# Altium schematic sheet Relay Board_Rev1-3 - Altium.schdoc
size 604 x 429 mm
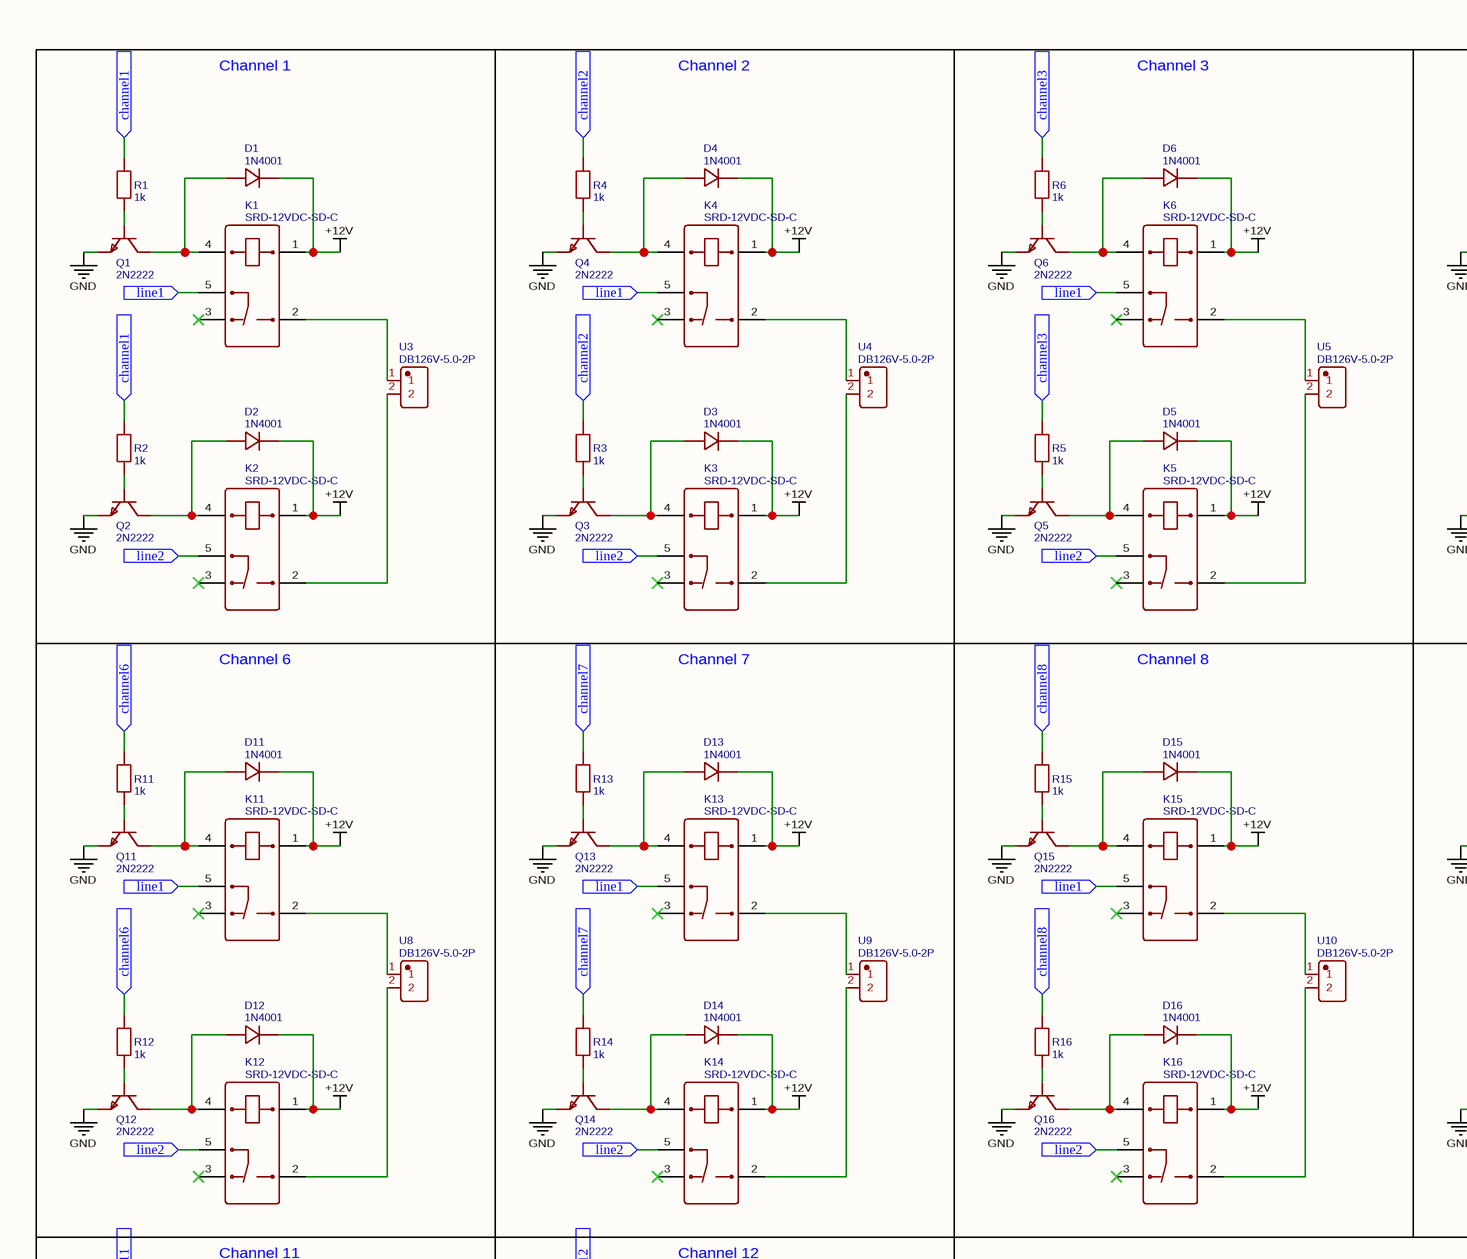
[diagram p0: Relay Board_Rev1-3 - Altium.schdoc, top left]
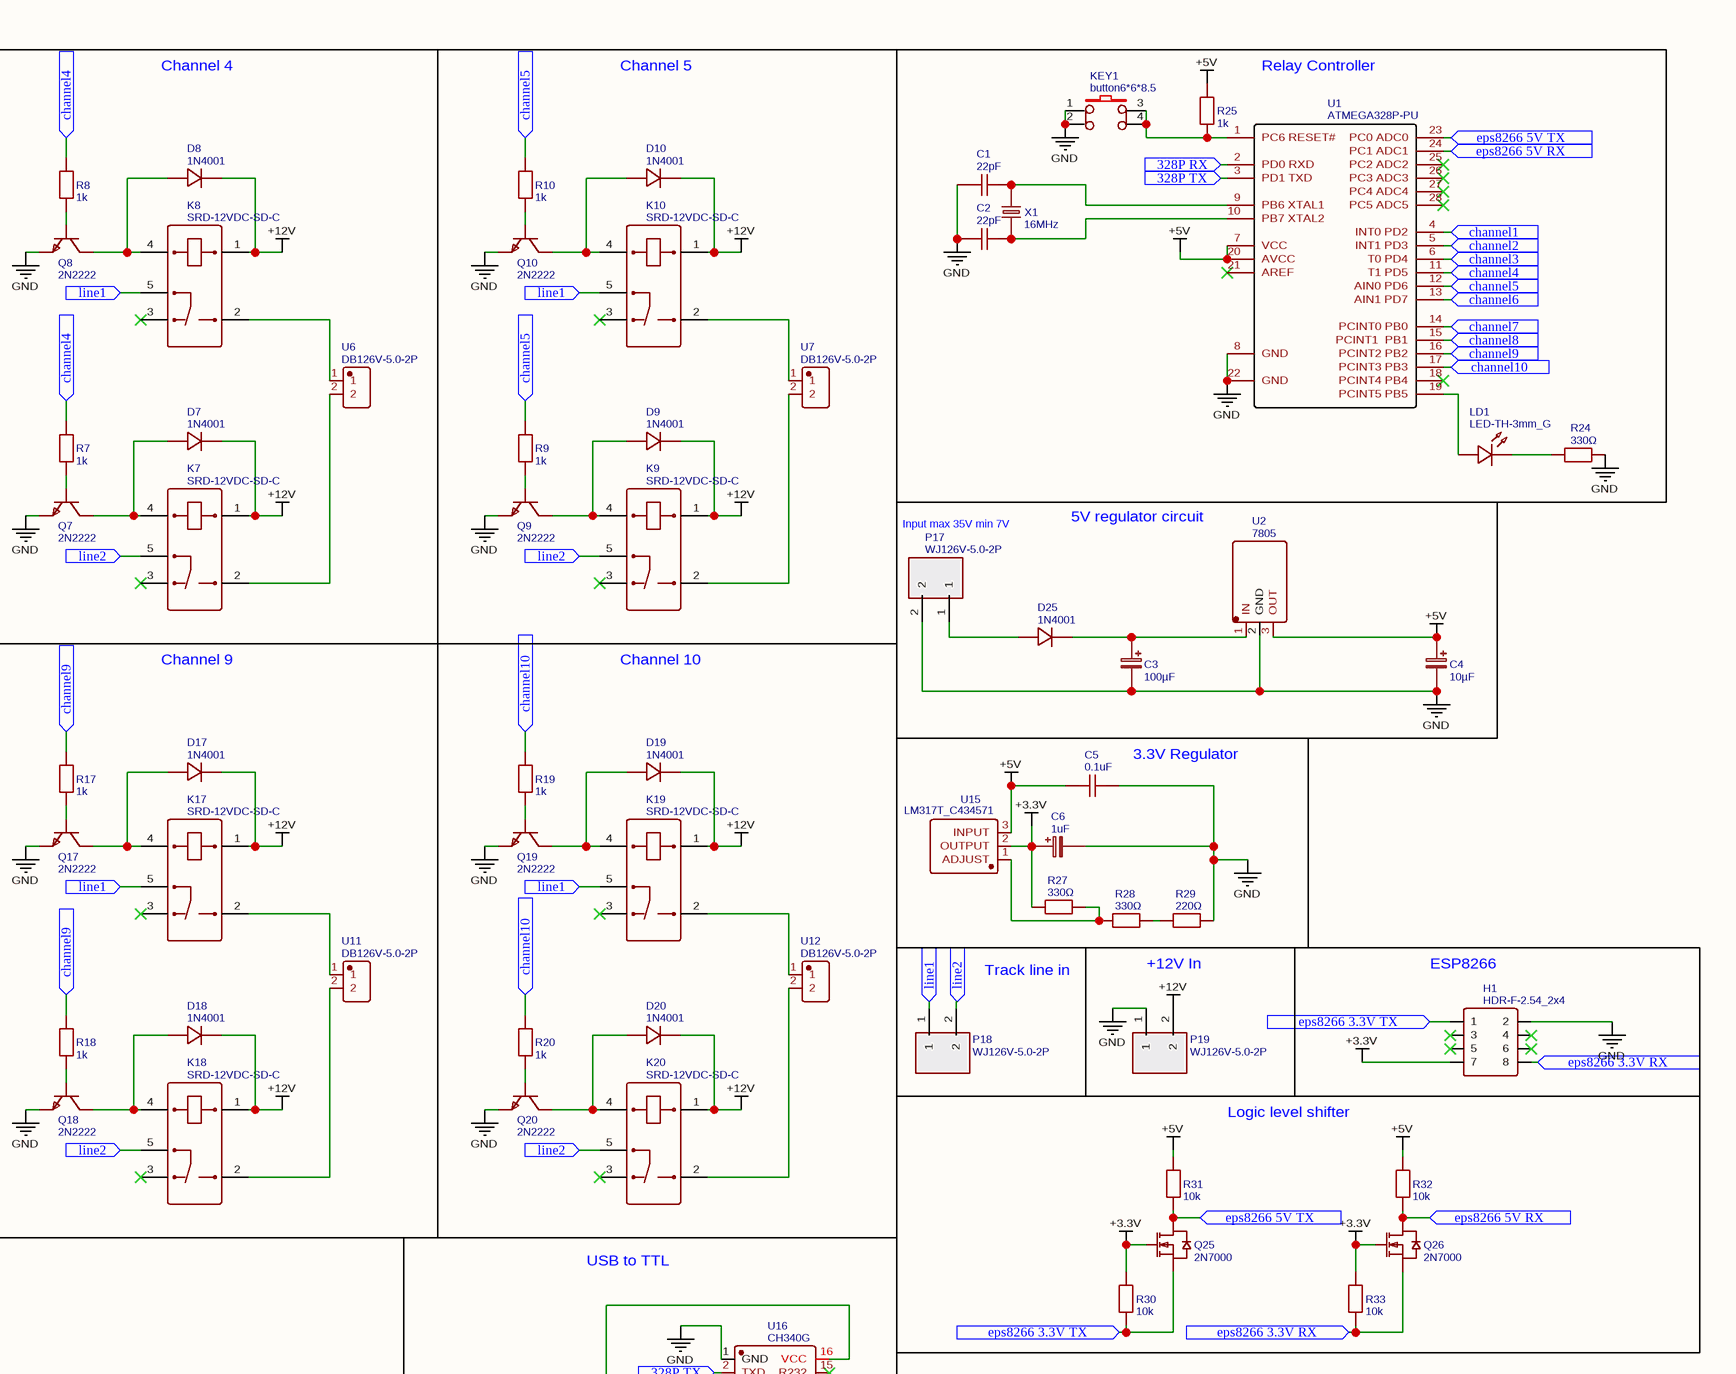
[diagram p1: Relay Board_Rev1-3 - Altium.schdoc, top right]
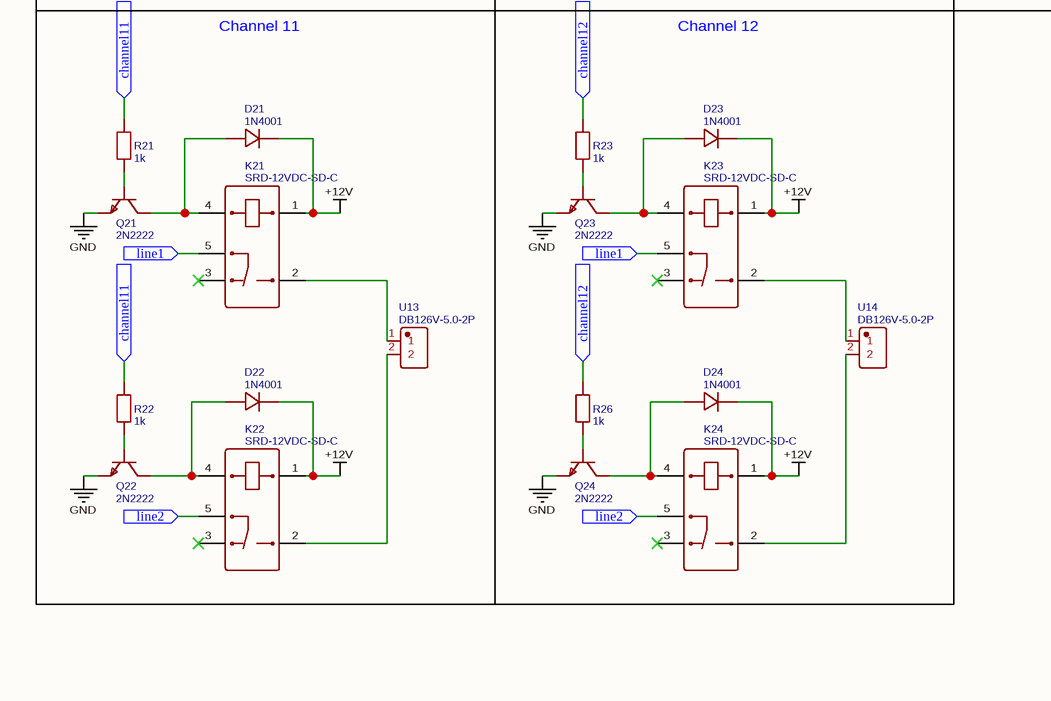
[diagram p2: Relay Board_Rev1-3 - Altium.schdoc, bottom left]
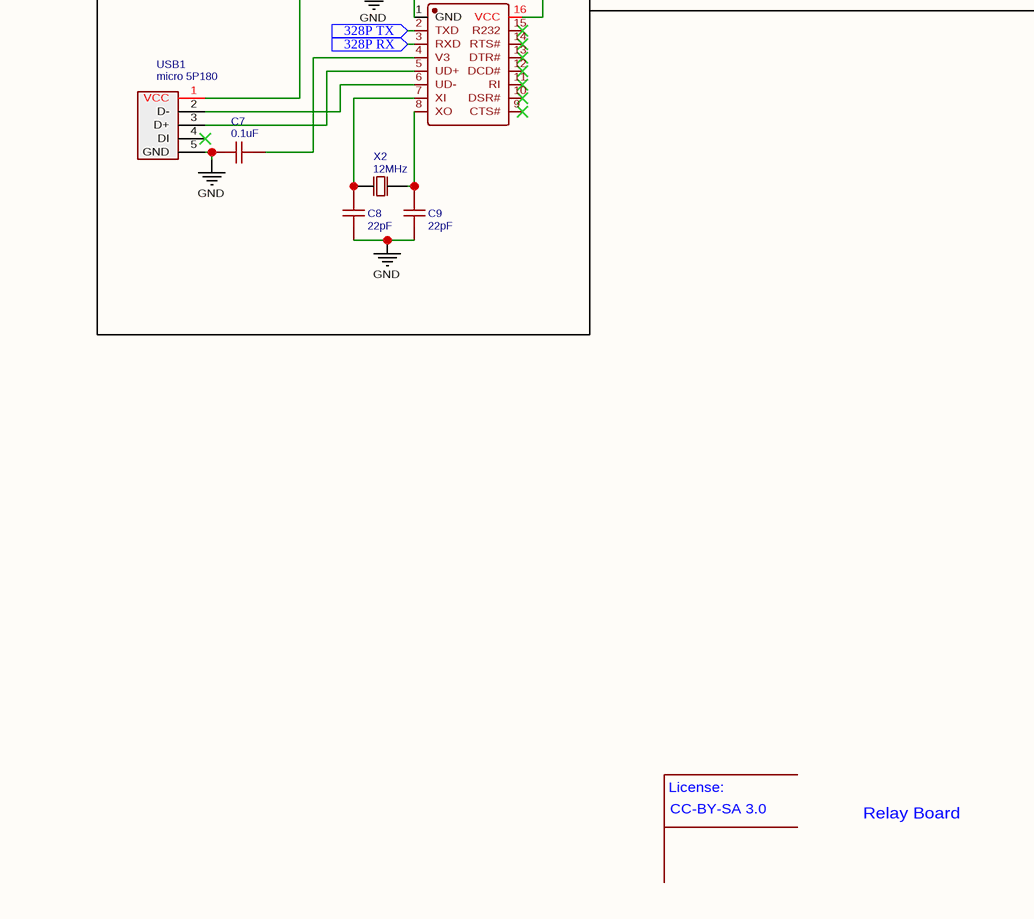
[diagram p3: Relay Board_Rev1-3 - Altium.schdoc, bottom right]

## Parts
C1  22pF  [RAD-0.2]
C2  22pF  [RAD-0.2]
C3  100µF  [CAP-D3.0×F1.5]
C4  10µF  [CAP-D3.0×F1.5]
C5  0.1uF  [RAD-0.2]
C6  1uF  [CAP-D3.0×F1.5]
C7  0.1uF  [RAD-0.2]
C8  22pF  [RAD-0.2]
C9  22pF  [RAD-0.2]
D1  1N4001  [DO-41_BD2.4-L4.7-P8.70-D0.9-RD]
D2  1N4001  [DO-41_BD2.4-L4.7-P8.70-D0.9-RD]
D3  1N4001  [DO-41_BD2.4-L4.7-P8.70-D0.9-RD]
D4  1N4001  [DO-41_BD2.4-L4.7-P8.70-D0.9-RD]
D5  1N4001  [DO-41_BD2.4-L4.7-P8.70-D0.9-RD]
D6  1N4001  [DO-41_BD2.4-L4.7-P8.70-D0.9-RD]
D7  1N4001  [DO-41_BD2.4-L4.7-P8.70-D0.9-RD]
D8  1N4001  [DO-41_BD2.4-L4.7-P8.70-D0.9-RD]
D9  1N4001  [DO-41_BD2.4-L4.7-P8.70-D0.9-RD]
D10  1N4001  [DO-41_BD2.4-L4.7-P8.70-D0.9-RD]
D11  1N4001  [DO-41_BD2.4-L4.7-P8.70-D0.9-RD]
D12  1N4001  [DO-41_BD2.4-L4.7-P8.70-D0.9-RD]
D13  1N4001  [DO-41_BD2.4-L4.7-P8.70-D0.9-RD]
D14  1N4001  [DO-41_BD2.4-L4.7-P8.70-D0.9-RD]
D15  1N4001  [DO-41_BD2.4-L4.7-P8.70-D0.9-RD]
D16  1N4001  [DO-41_BD2.4-L4.7-P8.70-D0.9-RD]
D17  1N4001  [DO-41_BD2.4-L4.7-P8.70-D0.9-RD]
D18  1N4001  [DO-41_BD2.4-L4.7-P8.70-D0.9-RD]
D19  1N4001  [DO-41_BD2.4-L4.7-P8.70-D0.9-RD]
D20  1N4001  [DO-41_BD2.4-L4.7-P8.70-D0.9-RD]
D21  1N4001  [DO-41_BD2.4-L4.7-P8.70-D0.9-RD]
D22  1N4001  [DO-41_BD2.4-L4.7-P8.70-D0.9-RD]
D23  1N4001  [DO-41_BD2.4-L4.7-P8.70-D0.9-RD]
D24  1N4001  [DO-41_BD2.4-L4.7-P8.70-D0.9-RD]
D25  1N4001  [DO-41_BD2.4-L4.7-P8.70-D0.9-RD]
H1  HDR-F-2.54_2x4  [HDR-F-2.54_2X4]
K1  SRD-12VDC-SD-C  [RELAY-TH_SRD-XXVDC-SD-C]
K2  SRD-12VDC-SD-C  [RELAY-TH_SRD-XXVDC-SD-C]
K3  SRD-12VDC-SD-C  [RELAY-TH_SRD-XXVDC-SD-C]
K4  SRD-12VDC-SD-C  [RELAY-TH_SRD-XXVDC-SD-C]
K5  SRD-12VDC-SD-C  [RELAY-TH_SRD-XXVDC-SD-C]
K6  SRD-12VDC-SD-C  [RELAY-TH_SRD-XXVDC-SD-C]
K7  SRD-12VDC-SD-C  [RELAY-TH_SRD-XXVDC-SD-C]
K8  SRD-12VDC-SD-C  [RELAY-TH_SRD-XXVDC-SD-C]
K9  SRD-12VDC-SD-C  [RELAY-TH_SRD-XXVDC-SD-C]
K10  SRD-12VDC-SD-C  [RELAY-TH_SRD-XXVDC-SD-C]
K11  SRD-12VDC-SD-C  [RELAY-TH_SRD-XXVDC-SD-C]
K12  SRD-12VDC-SD-C  [RELAY-TH_SRD-XXVDC-SD-C]
K13  SRD-12VDC-SD-C  [RELAY-TH_SRD-XXVDC-SD-C]
K14  SRD-12VDC-SD-C  [RELAY-TH_SRD-XXVDC-SD-C]
K15  SRD-12VDC-SD-C  [RELAY-TH_SRD-XXVDC-SD-C]
K16  SRD-12VDC-SD-C  [RELAY-TH_SRD-XXVDC-SD-C]
K17  SRD-12VDC-SD-C  [RELAY-TH_SRD-XXVDC-SD-C]
K18  SRD-12VDC-SD-C  [RELAY-TH_SRD-XXVDC-SD-C]
K19  SRD-12VDC-SD-C  [RELAY-TH_SRD-XXVDC-SD-C]
K20  SRD-12VDC-SD-C  [RELAY-TH_SRD-XXVDC-SD-C]
K21  SRD-12VDC-SD-C  [RELAY-TH_SRD-XXVDC-SD-C]
K22  SRD-12VDC-SD-C  [RELAY-TH_SRD-XXVDC-SD-C]
K23  SRD-12VDC-SD-C  [RELAY-TH_SRD-XXVDC-SD-C]
K24  SRD-12VDC-SD-C  [RELAY-TH_SRD-XXVDC-SD-C]
KEY1  button6*6*8.5  [KEY-TH_4P-L6.0-W6.0-P4.50]
LD1  LED-TH-3mm_G  [LED-TH_BD3.0_GREEN]
P17  WJ126V-5.0-2P  [WJ126V-5.0-2P]
P18  WJ126V-5.0-2P  [WJ126V-5.0-2P]
P19  WJ126V-5.0-2P  [WJ126V-5.0-2P]
Q1  2N2222  [TO-92-3_L4.9-W3.7-P1.27-L]
Q2  2N2222  [TO-92-3_L4.9-W3.7-P1.27-L]
Q3  2N2222  [TO-92-3_L4.9-W3.7-P1.27-L]
Q4  2N2222  [TO-92-3_L4.9-W3.7-P1.27-L]
Q5  2N2222  [TO-92-3_L4.9-W3.7-P1.27-L]
Q6  2N2222  [TO-92-3_L4.9-W3.7-P1.27-L]
Q7  2N2222  [TO-92-3_L4.9-W3.7-P1.27-L]
Q8  2N2222  [TO-92-3_L4.9-W3.7-P1.27-L]
Q9  2N2222  [TO-92-3_L4.9-W3.7-P1.27-L]
Q10  2N2222  [TO-92-3_L4.9-W3.7-P1.27-L]
Q11  2N2222  [TO-92-3_L4.9-W3.7-P1.27-L]
Q12  2N2222  [TO-92-3_L4.9-W3.7-P1.27-L]
Q13  2N2222  [TO-92-3_L4.9-W3.7-P1.27-L]
Q14  2N2222  [TO-92-3_L4.9-W3.7-P1.27-L]
Q15  2N2222  [TO-92-3_L4.9-W3.7-P1.27-L]
Q16  2N2222  [TO-92-3_L4.9-W3.7-P1.27-L]
Q17  2N2222  [TO-92-3_L4.9-W3.7-P1.27-L]
Q18  2N2222  [TO-92-3_L4.9-W3.7-P1.27-L]
Q19  2N2222  [TO-92-3_L4.9-W3.7-P1.27-L]
Q20  2N2222  [TO-92-3_L4.9-W3.7-P1.27-L]
Q21  2N2222  [TO-92-3_L4.9-W3.7-P1.27-L]
Q22  2N2222  [TO-92-3_L4.9-W3.7-P1.27-L]
Q23  2N2222  [TO-92-3_L4.9-W3.7-P1.27-L]
Q24  2N2222  [TO-92-3_L4.9-W3.7-P1.27-L]
Q25  2N7000  [TO-92-3_L4.9-W3.7-P1.27-L]
Q26  2N7000  [TO-92-3_L4.9-W3.7-P1.27-L]
R1  1k  [R_AXIAL-0.4]
R2  1k  [R_AXIAL-0.4]
R3  1k  [R_AXIAL-0.4]
R4  1k  [R_AXIAL-0.4]
R5  1k  [R_AXIAL-0.4]
R6  1k  [R_AXIAL-0.4]
R7  1k  [R_AXIAL-0.4]
R8  1k  [R_AXIAL-0.4]
R9  1k  [R_AXIAL-0.4]
R10  1k  [R_AXIAL-0.4]
R11  1k  [R_AXIAL-0.4]
R12  1k  [R_AXIAL-0.4]
R13  1k  [R_AXIAL-0.4]
R14  1k  [R_AXIAL-0.4]
R15  1k  [R_AXIAL-0.4]
R16  1k  [R_AXIAL-0.4]
R17  1k  [R_AXIAL-0.4]
R18  1k  [R_AXIAL-0.4]
R19  1k  [R_AXIAL-0.4]
R20  1k  [R_AXIAL-0.4]
R21  1k  [R_AXIAL-0.4]
R22  1k  [R_AXIAL-0.4]
R23  1k  [R_AXIAL-0.4]
R24  330Ω  [R_AXIAL-0.4]
R25  1k  [R_AXIAL-0.4]
R26  1k  [R_AXIAL-0.4]
R27  330Ω  [R_AXIAL-0.4]
R28  330Ω  [R_AXIAL-0.4]
R29  220Ω  [R_AXIAL-0.4]
R30  10k  [R_AXIAL-0.4]
R31  10k  [R_AXIAL-0.4]
R32  10k  [R_AXIAL-0.4]
R33  10k  [R_AXIAL-0.4]
U1  ATMEGA328P-PU  [DIP-28_L34.6-W7.3-P2.54-LS10.2-BL]
U2  7805  [TO-220-3_L10.0-W4.5-P2.54-L]
U3  DB126V-5.0-2P  [CONN-TH_2P-P5.00_L7.8-W10.0]
U4  DB126V-5.0-2P  [CONN-TH_2P-P5.00_L7.8-W10.0]
U5  DB126V-5.0-2P  [CONN-TH_2P-P5.00_L7.8-W10.0]
U6  DB126V-5.0-2P  [CONN-TH_2P-P5.00_L7.8-W10.0]
U7  DB126V-5.0-2P  [CONN-TH_2P-P5.00_L7.8-W10.0]
U8  DB126V-5.0-2P  [CONN-TH_2P-P5.00_L7.8-W10.0]
U9  DB126V-5.0-2P  [CONN-TH_2P-P5.00_L7.8-W10.0]
U10  DB126V-5.0-2P  [CONN-TH_2P-P5.00_L7.8-W10.0]
U11  DB126V-5.0-2P  [CONN-TH_2P-P5.00_L7.8-W10.0]
U12  DB126V-5.0-2P  [CONN-TH_2P-P5.00_L7.8-W10.0]
U13  DB126V-5.0-2P  [CONN-TH_2P-P5.00_L7.8-W10.0]
U14  DB126V-5.0-2P  [CONN-TH_2P-P5.00_L7.8-W10.0]
U15  LM317T_C434571  [TO-220-3_L10.0-W4.5-P2.54-L]
U16  CH340G  [SOIC-16_L9.9-W3.9-P1.27-LS6.0-BR]
USB1  micro 5P180  [MICRO-USB-TH_U-MICRS05P-BF00]
X1  16MHz  [HC-49US_L11.5-W4.5-P4.88]
X2  12MHz  [HC-49US_L11.5-W4.5-P4.88]

## Blocks framed on the sheet
Channel 1: D1 D2 K1 K2 Q1 Q2 R1 R2 U3
Channel 2: D3 D4 K3 K4 Q3 Q4 R3 R4 U4
Channel 3: D5 D6 K5 K6 Q5 Q6 R5 R6 U5
Channel 4: D7 D8 K7 K8 Q7 Q8 R7 R8 U6
Channel 5: D9 D10 K9 K10 Q9 Q10 R9 R10 U7
Relay Controller: C1 C2 KEY1 LD1 R24 R25 U1 X1
5V regulator circuit: C3 C4 D25 P17 U2
Channel 6: D11 D12 K11 K12 Q11 Q12 R11 R12 U8
Channel 7: D13 D14 K13 K14 Q13 Q14 R13 R14 U9
Channel 8: D15 D16 K15 K16 Q15 Q16 R15 R16 U10
Channel 9: D17 D18 K17 K18 Q17 Q18 R17 R18 U11
Channel 10: D19 D20 K19 K20 Q19 Q20 R19 R20 U12
3.3V Regulator: C5 C6 R27-R29 U15
Track line in: P18
+12V In: P19
ESP8266: H1
Logic level shifter: Q25 Q26 R30-R33
Channel 11: D21 D22 K21 K22 Q21 Q22 R21 R22 U13
Channel 12: D23 D24 K23 K24 Q23 Q24 R23 R26 U14
USB to TTL: C7-C9 U16 USB1 X2

## Ports
328P RX (in), 328P TX (in), channel1 (in), channel2 (in), channel3 (in), channel4 (in), channel5 (in), channel6 (in), channel7 (in), channel8 (in), channel9 (in), channel10 (in), channel11 (in), channel12 (in), eps8266 3.3V RX (in), eps8266 3.3V TX (in), eps8266 5V RX (in), eps8266 5V TX (in), line1 (in), line2 (in)

## Nets
+3.3V: C6.1 H1.7 Q25.2(G) Q26.2(G) R27.2 R30.2 R33.2 U15.2(OUTPUT)
+5V: C4.1 C5.2 R25.2 R31.2 R32.2 U1.7(VCC) U1.20(AVCC) U2.3(OUT) U15.3(INPUT)
+12V: D1.1(K) D2.1(K) D3.1(K) D4.1(K) D5.1(K) D6.1(K) D7.1(K) D8.1(K) D9.1(K) D10.1(K) D11.1(K) D12.1(K) D13.1(K) D14.1(K) D15.1(K) D16.1(K) D17.1(K) D18.1(K) D19.1(K) D20.1(K) D21.1(K) D22.1(K) D23.1(K) D24.1(K) K1.1 K2.1 K3.1 K4.1 K5.1 K6.1 K7.1 K8.1 K9.1 K10.1 K11.1 K12.1 K13.1 K14.1 K15.1 K16.1 K17.1 K18.1 K19.1 K20.1 K21.1 K22.1 K23.1 K24.1 P19.2
GND: C1.1 C2.1 C3.2 C4.2 C5.1 C6.2 C7.2 C8.1 C9.1 H1.2 KEY1.1 KEY1.2 P17.2 P19.1 Q1.1(E) Q2.1(E) Q3.1(E) Q4.1(E) Q5.1(E) Q6.1(E) Q7.1(E) Q8.1(E) Q9.1(E) Q10.1(E) Q11.1(E) Q12.1(E) Q13.1(E) Q14.1(E) Q15.1(E) Q16.1(E) Q17.1(E) Q18.1(E) Q19.1(E) Q20.1(E) Q21.1(E) Q22.1(E) Q23.1(E) Q24.1(E) R24.2 R29.2 U1.8(GND) U1.22(GND) U2.2(GND) U16.1(GND) USB1.5(GND)
328P RX: U1.2(PD0_RXD) U16.3(RXD) ; port 328P RX
328P TX: U1.3(PD1_TXD) U16.2(TXD) ; port 328P TX
channel1: R1.2 R2.2 U1.4(INT0_PD2) ; port channel1
channel2: R3.2 R4.2 U1.5(INT1_PD3) ; port channel2
channel3: R5.2 R6.2 U1.6(T0_PD4) ; port channel3
channel4: R7.2 R8.2 U1.11(T1_PD5) ; port channel4
channel5: R9.2 R10.2 U1.12(AIN0_PD6) ; port channel5
channel6: R11.2 R12.2 U1.13(AIN1_PD7) ; port channel6
channel7: R13.2 R14.2 U1.14(PCINT0_PB0) ; port channel7
channel8: R15.2 R16.2 U1.15(PCINT1__PB1) ; port channel8
channel9: R17.2 R18.2 U1.16(PCINT2_PB2) ; port channel9
channel10: R19.2 R20.2 U1.17(PCINT3_PB3) ; port channel10
channel11: R21.2 R22.2 ; port channel11
channel12: R23.2 R26.2 ; port channel12
eps8266 3.3V RX: H1.8 Q26.1(S) R33.1 ; port eps8266 3.3V RX
eps8266 3.3V TX: H1.1 Q25.1(S) R30.1 ; port eps8266 3.3V TX
eps8266 5V RX: Q26.3(D) R32.1 U1.24(PC1_ADC1) ; port eps8266 5V RX
eps8266 5V TX: Q25.3(D) R31.1 U1.23(PC0_ADC0) ; port eps8266 5V TX
line1: K1.5 K4.5 K6.5 K8.5 K10.5 K11.5 K13.5 K15.5 K17.5 K19.5 K21.5 K23.5 P18.1 ; port line1
line2: K2.5 K3.5 K5.5 K7.5 K9.5 K12.5 K14.5 K16.5 K18.5 K20.5 K22.5 K24.5 P18.2 ; port line2
NetC1_2: C1.2 U1.9(PB6_XTAL1) X1.1
NetC2_2: C2.2 U1.10(PB7_XTAL2) X1.2
NetC3_1: C3.1 D25.1(K) U2.1(IN)
NetC7_1: C7.1 U16.4(V3)
NetC8_2: C8.2 U16.7(XI) X2.1(OSC1)
NetC9_2: C9.2 U16.8(XO) X2.2(OSC2)
NetD1_2: D1.2(A) K1.4 Q1.3(C)
NetD2_2: D2.2(A) K2.4 Q2.3(C)
NetD3_2: D3.2(A) K3.4 Q3.3(C)
NetD4_2: D4.2(A) K4.4 Q4.3(C)
NetD5_2: D5.2(A) K5.4 Q5.3(C)
NetD6_2: D6.2(A) K6.4 Q6.3(C)
NetD7_2: D7.2(A) K7.4 Q7.3(C)
NetD8_2: D8.2(A) K8.4 Q8.3(C)
NetD9_2: D9.2(A) K9.4 Q9.3(C)
NetD10_2: D10.2(A) K10.4 Q10.3(C)
NetD11_2: D11.2(A) K11.4 Q11.3(C)
NetD12_2: D12.2(A) K12.4 Q12.3(C)
NetD13_2: D13.2(A) K13.4 Q13.3(C)
NetD14_2: D14.2(A) K14.4 Q14.3(C)
NetD15_2: D15.2(A) K15.4 Q15.3(C)
NetD16_2: D16.2(A) K16.4 Q16.3(C)
NetD17_2: D17.2(A) K17.4 Q17.3(C)
NetD18_2: D18.2(A) K18.4 Q18.3(C)
NetD19_2: D19.2(A) K19.4 Q19.3(C)
NetD20_2: D20.2(A) K20.4 Q20.3(C)
NetD21_2: D21.2(A) K21.4 Q21.3(C)
NetD22_2: D22.2(A) K22.4 Q22.3(C)
NetD23_2: D23.2(A) K23.4 Q23.3(C)
NetD24_2: D24.2(A) K24.4 Q24.3(C)
NetD25_2: D25.2(A) P17.1
NetK1_2: K1.2 U3.1
NetK2_2: K2.2 U3.2
NetK3_2: K3.2 U4.2
NetK4_2: K4.2 U4.1
NetK5_2: K5.2 U5.2
NetK6_2: K6.2 U5.1
NetK7_2: K7.2 U6.2
NetK8_2: K8.2 U6.1
NetK9_2: K9.2 U7.2
NetK10_2: K10.2 U7.1
NetK11_2: K11.2 U8.1
NetK12_2: K12.2 U8.2
NetK13_2: K13.2 U9.1
NetK14_2: K14.2 U9.2
NetK15_2: K15.2 U10.1
NetK16_2: K16.2 U10.2
NetK17_2: K17.2 U11.1
NetK18_2: K18.2 U11.2
NetK19_2: K19.2 U12.1
NetK20_2: K20.2 U12.2
NetK21_2: K21.2 U13.1
NetK22_2: K22.2 U13.2
NetK23_2: K23.2 U14.1
NetK24_2: K24.2 U14.2
NetKEY1_3: KEY1.3 KEY1.4 R25.1 U1.1(PC6_RESET#)
NetLD1_1: LD1.1 U1.19(PCINT5_PB5)
NetLD1_2: LD1.2 R24.1
NetQ1_2: Q1.2(B) R1.1
NetQ2_2: Q2.2(B) R2.1
NetQ3_2: Q3.2(B) R3.1
NetQ4_2: Q4.2(B) R4.1
NetQ5_2: Q5.2(B) R5.1
NetQ6_2: Q6.2(B) R6.1
NetQ7_2: Q7.2(B) R7.1
NetQ8_2: Q8.2(B) R8.1
NetQ9_2: Q9.2(B) R9.1
NetQ10_2: Q10.2(B) R10.1
NetQ11_2: Q11.2(B) R11.1
NetQ12_2: Q12.2(B) R12.1
NetQ13_2: Q13.2(B) R13.1
NetQ14_2: Q14.2(B) R14.1
NetQ15_2: Q15.2(B) R15.1
NetQ16_2: Q16.2(B) R16.1
NetQ17_2: Q17.2(B) R17.1
NetQ18_2: Q18.2(B) R18.1
NetQ19_2: Q19.2(B) R19.1
NetQ20_2: Q20.2(B) R20.1
NetQ21_2: Q21.2(B) R21.1
NetQ22_2: Q22.2(B) R22.1
NetQ23_2: Q23.2(B) R23.1
NetQ24_2: Q24.2(B) R26.1
NetR27_1: R27.1 R28.1 U15.1(ADJUST)
NetR28_2: R28.2 R29.1
NetU16_5: U16.5(UD+) USB1.3(D+)
NetU16_6: U16.6(UD-) USB1.2(D-)
NetU16_16: U16.16(VCC) USB1.1(VCC)

Not connected (* = marked no-connect by the designer): H1 3* 4* 5* 6*; K1 3*; K2 3*; K3 3*; K4 3*; K5 3*; K6 3*; K7 3*; K8 3*; K9 3*; K10 3*; K11 3*; K12 3*; K13 3*; K14 3*; K15 3*; K16 3*; K17 3*; K18 3*; K19 3*; K20 3*; K21 3*; K22 3*; K23 3*; K24 3*; U1 18(PCINT4_PB4)* 21(AREF)* 25(PC2_ADC2)* 26(PC3_ADC3)* 27(PC4_ADC4)* 28(PC5_ADC5)*; U16 9(CTS#)* 10(DSR#)* 11(RI)* 12(DCD#)* 13(DTR#)* 14(RTS#)* 15(R232)*; USB1 4(DI)*

## Notes on the sheet
- Input max 35V min 7V
- License:
- CC-BY-SA 3.0
- Relay Board

## Library data of the parts
C1 C2 C8 C9 = 22pF: nameAlias: Value(F); Contributor: LCEDA_Lib; spicePre: C; spiceSymbolName: C_RAD-0.2_US
C3 = 100µF: nameAlias: Value(F); Contributor: LCEDA_Lib; spicePre: C; spiceSymbolName: CE_TH_D3.0×F1.5_EU
C4 = 10µF: nameAlias: Value(F); Contributor: LCEDA_Lib; spicePre: C; spiceSymbolName: CE_TH_D3.0×F1.5_EU
C5 C7 = 0.1uF: nameAlias: Value(F); Contributor: LCEDA_Lib; spicePre: C; spiceSymbolName: C_RAD-0.2_US
C6 = 1uF: nameAlias: Value(F); Contributor: LCEDA_Lib; spicePre: C; spiceSymbolName: CE_TH_D3.0×F1.5_EU
D1-D25 = 1N4001: BOM_Manufacturer: LRC; BOM_Supplier: LCSC; BOM_Manufacturer Part: 1N4001; BOM_Supplier Part: C82804; spicePre: D; spiceSymbolName: 1N4001
H1 = HDR-F-2.54_2x4: Contributor: LCEDA_Lib; BOM_Supplier Part: C239344; BOM_Supplier: LCSC; spicePre: H; spiceSymbolName: HDR-F-2.54_2x4
K1-K24 = SRD-12VDC-SD-C: BOM_Manufacturer: Ningbo Songle Relay; Contributor: LCSC; BOM_Supplier: LCSC; BOM_Supplier Part: C247843; BOM_Manufacturer Part: SRD-12VDC-SD-C; spicePre: K; spiceSymbolName: SRD-12VDC-SD-C
KEY1 = button6*6*8.5: BOM_Manufacturer: ReliaPro; BOM_Supplier Part: C59980; BOM_Supplier: LCSC; BOM_Manufacturer Part: button6*6*8.5; image: http://image.lceda.cn/szlcsc/C59980.jpg; spicePre: K; spiceSymbolName: button6*6*8.5
LD1 = LED-TH-3mm_G: BOM_Manufacturer: EVERLIGHT(台湾亿光); BOM_Manufacturer Part: 204-10SYGD/S530-E3; Contributor: LCEDA_Lib; BOM_Supplier Part: C85161; spicePre: L; spiceSymbolName: LED-TH-3mm_G
P17-P19 = WJ126V-5.0-2P: BOM_Manufacturer: ReliaPro; BOM_Supplier: LCSC; BOM_Manufacturer Part: WJ126V-5.0-2P; image: //image.lceda.cn/szlcsc/C8404.jpg; BOM_Supplier Part: C8404; spicePre: P; spiceSymbolName: WJ126V-5.0-2P
Q1-Q24 = 2N2222: BOM_Manufacturer: SEMTECH; Contributor: LCSC; BOM_Supplier: LCSC; BOM_Manufacturer Part: 2N2222; BOM_Supplier Part: C118536; spicePre: Q; spiceSymbolName: 2N2222
Q25 Q26 = 2N7000: BOM_Manufacturer: CJ; BOM_Supplier: LCSC; BOM_Manufacturer Part: 2N7000; image: //image.lceda.cn/szlcsc/C9114.jpg; BOM_Supplier Part: C9114; spicePre: Q; spiceSymbolName: 2N7000
R1-R23 R25 R26 = 1k: nameAlias: Value(Ω); Contributor: LCEDA_Lib; spicePre: R; spiceSymbolName: R_AXIAL-0.4_EU
R24 R27 R28 = 330Ω: nameAlias: Value(Ω); Contributor: LCEDA_Lib; spicePre: R; spiceSymbolName: R_AXIAL-0.4_EU
R29 = 220Ω: nameAlias: Value(Ω); Contributor: LCEDA_Lib; spicePre: R; spiceSymbolName: R_AXIAL-0.4_EU
R30-R33 = 10k: nameAlias: Value(Ω); Contributor: LCEDA_Lib; spicePre: R; spiceSymbolName: R_AXIAL-0.4_EU
U1 = ATMEGA328P-PU: BOM_Manufacturer: MICROCHIP; sourceId: Oic6oiASL; Contributor: LCSC; timeStamp: 1451725987; BOM_Supplier: LCSC; BOM_Manufacturer Part: ATMEGA328P-PU; image: //image.lceda.cn/szlcsc/C33901.jpg; BOM_Supplier Part: C33901; spicePre: U; spiceSymbolName: ATMEGA328P-PU
U2 = 7805: BOM_Manufacturer: Foshan Blue Rocket Elec; Contributor: LCSC; BOM_Supplier: LCSC; BOM_Supplier Part: C305416; BOM_Manufacturer Part: 7805; spicePre: U; spiceSymbolName: 7805
U3-U14 = DB126V-5.0-2P: BOM_Manufacturer: DIBO; Contributor: LCSC; BOM_Supplier: LCSC; BOM_Supplier Part: C395849; BOM_Manufacturer Part: DB126V-5.0-2P; spicePre: U; spiceSymbolName: DB126V-5.0-2P
U15 = LM317T_C434571: BOM_Manufacturer: HGSEMI; BOM_Manufacturer Part: LM317T; Contributor: LCSC; BOM_Supplier: LCSC; BOM_Supplier Part: C434571; spicePre: U; spiceSymbolName: LM317T_C434571
U16 = CH340G: BOM_Manufacturer: WCH; SMT Type: Basic; timeStamp: 1468327462; BOM_Supplier: LCSC; BOM_Manufacturer Part: CH340G; BOM_LCSC Assembly: Yes; image: //image.lceda.cn/szlcsc/C14267.jpg; BOM_Supplier Part: C14267; spicePre: U; spiceSymbolName: CH340G
USB1 = micro 5P180: BOM_Manufacturer: ValuePro; BOM_Supplier: LCSC; BOM_Manufacturer Part: micro 5P180; image: //image.lceda.cn/szlcsc/C40941.jpg; BOM_Supplier Part: C40941; spicePre: U; spiceSymbolName: micro 5P180
X1 = 16MHz: BOM_Manufacturer: TAITIEN Elec; BOM_Manufacturer Part: XIHCELNANF-16MHZ; nameAlias: Frequency; Contributor: LCSC; BOM_Supplier: LCSC; BOM_Supplier Part: C295075; spicePre: X; spiceSymbolName: XIHCELNANF-16MHZ
X2 = 12MHz: BOM_Manufacturer: Suzhou Liming Elec; BOM_Manufacturer Part: 49S-12.00-20-20-20/A; nameAlias: Frequency; Contributor: LCSC; BOM_Supplier: LCSC; BOM_Supplier Part: C240914; spicePre: X; spiceSymbolName: 49S-12.00-20-20-20/A